# Altium project Edge_Card_Ucc28951.PrjPcb (part 3 of 3)

## Sheet Ucc_28951_Breakout.SchDoc
size C
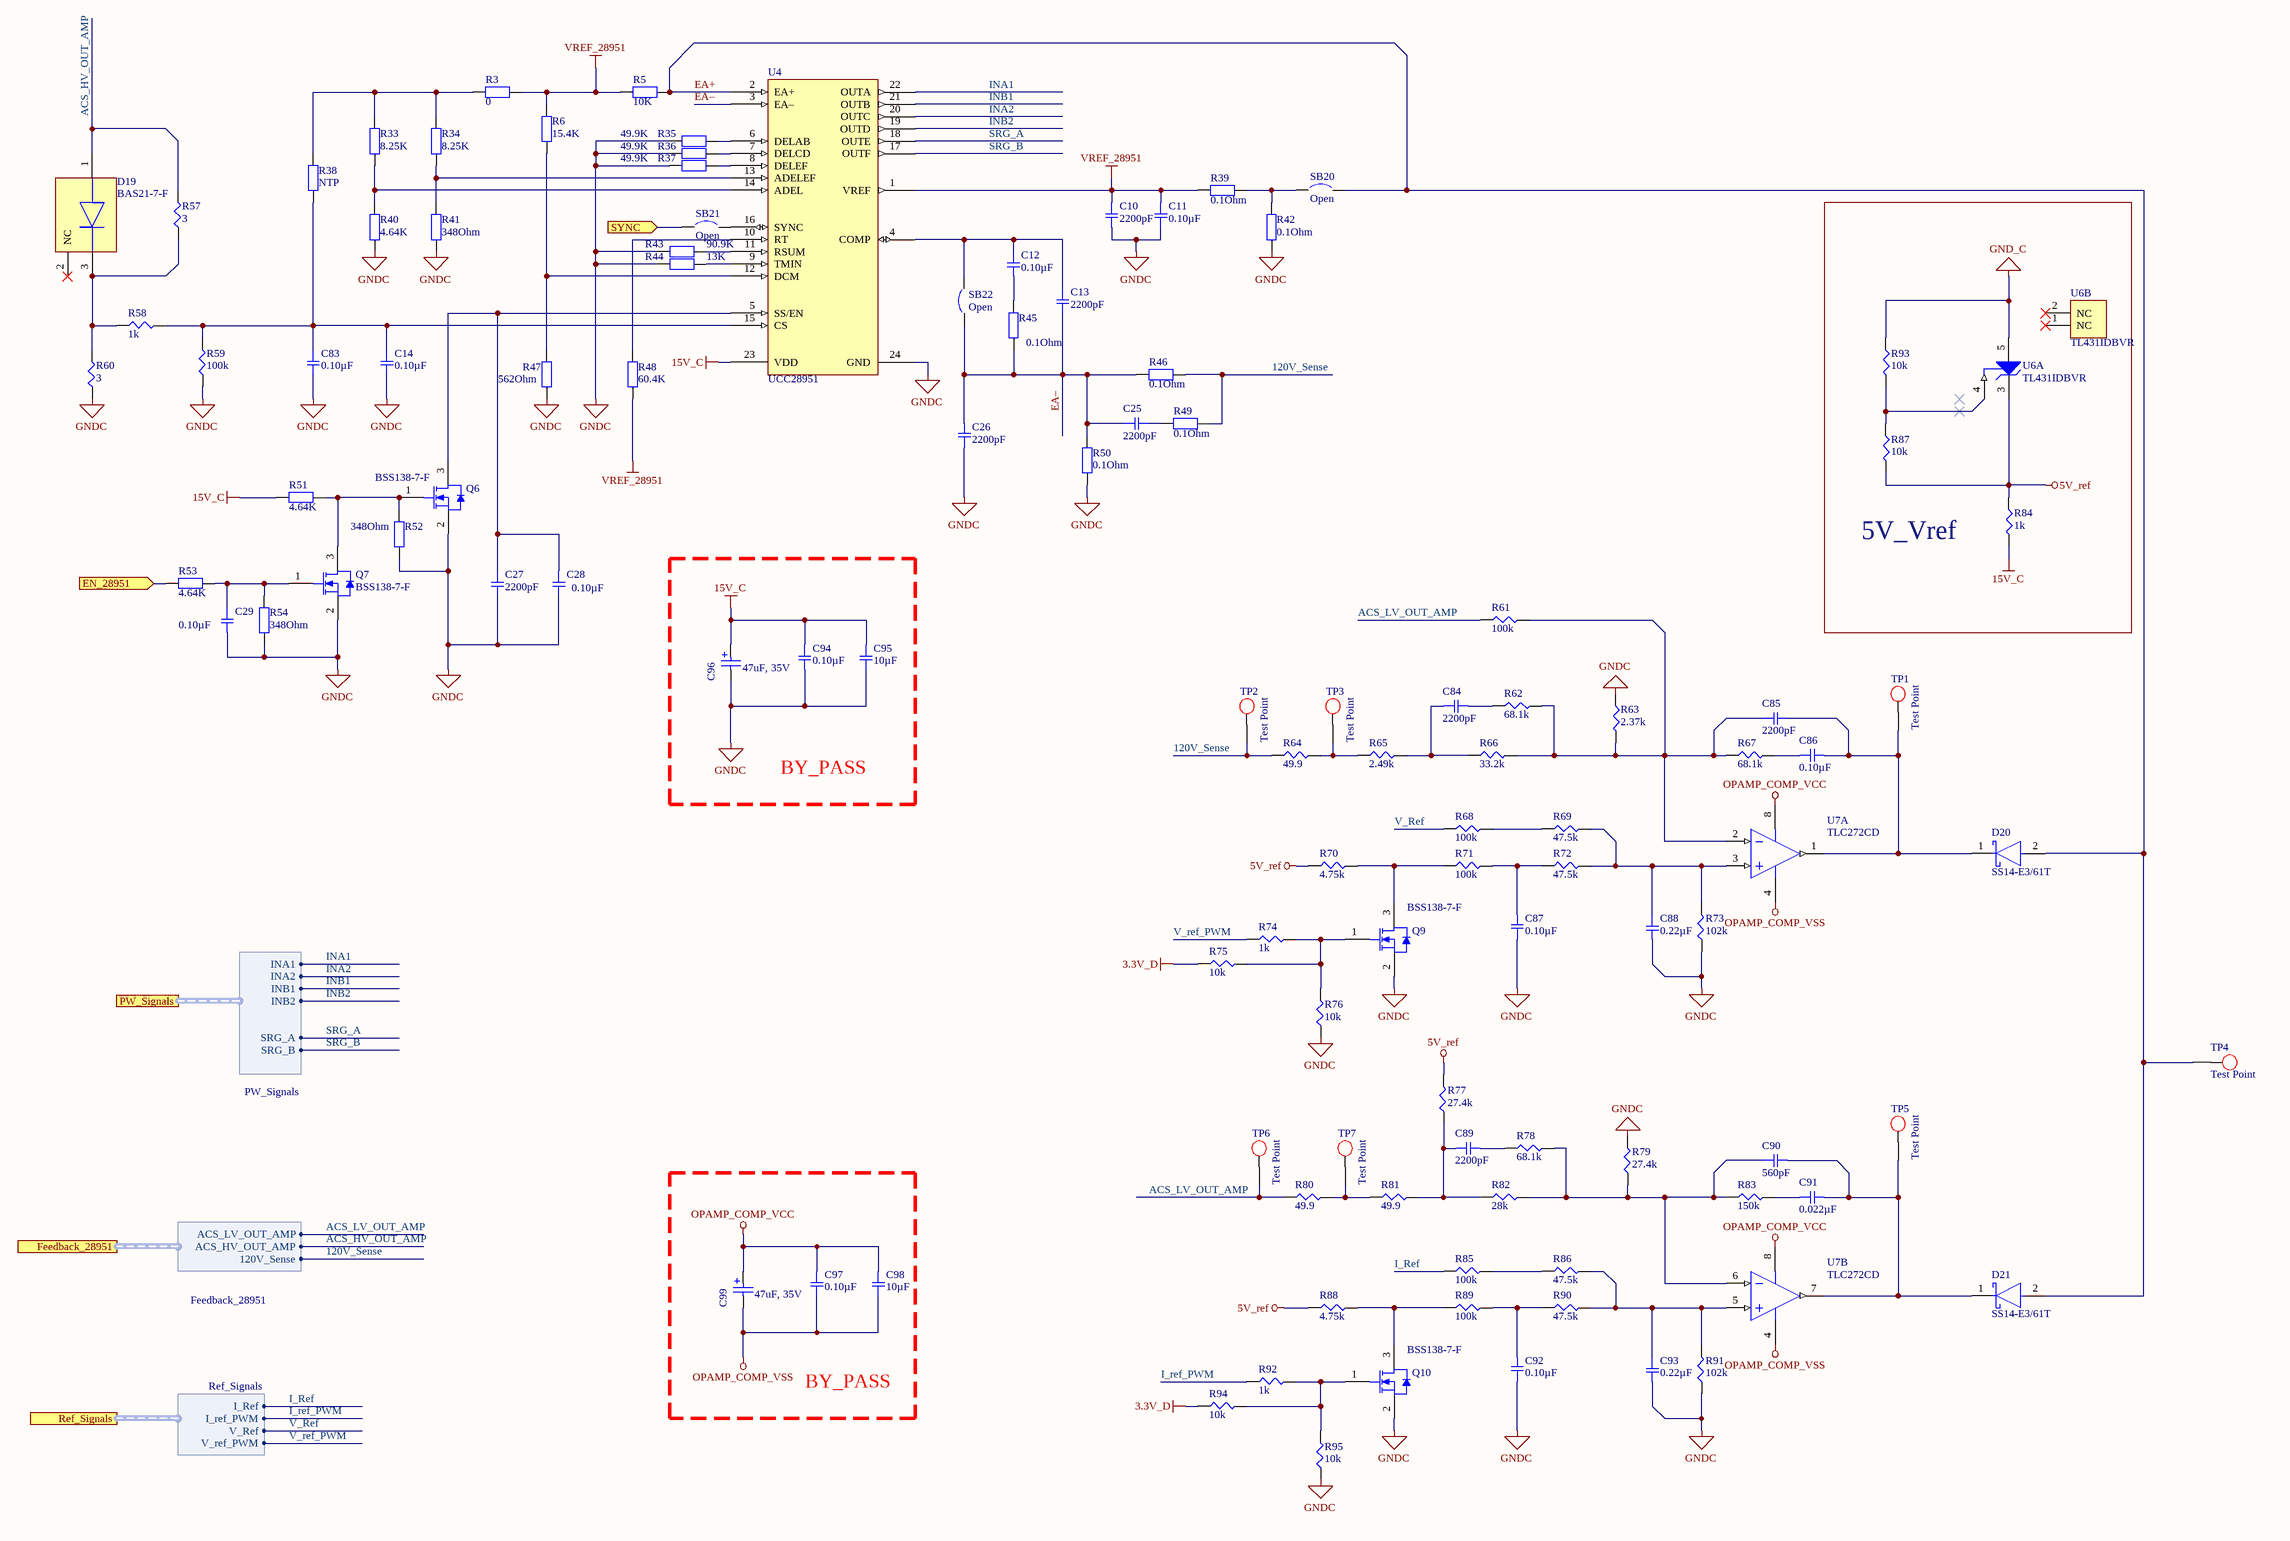
[diagram p11: Ucc_28951_Breakout.SchDoc]

### Parts
C10  2200pF  [SMD-0805C]
C11  0.10µF  [SMD-0805C]
C12  0.10µF  [SMD-0805C]
C13  2200pF  [SMD-0805C]
C14  0.10µF  [SMD-0805C]
C25  2200pF  [SMD-0805C]
C26  2200pF  [SMD-0805C]
C27  2200pF  [SMD-0805C]
C28  0.10µF  [SMD-0805C]
C29  0.10µF  [SMD-0805C]
C83  0.10µF  [SMD-0805C]
C84  2200pF  [SMD-0603C]
C85  2200pF  [SMD-0603C]
C86  0.10µF  [SMD-0603C]
C87  0.10µF  [SMD-0603C]
C88  0.22µF  [SMD-0603C]
C89  2200pF  [SMD-0603C]
C90  560pF  [SMD-0603C]
C91  0.022µF  [SMD-0603C]
C92  0.10µF  [SMD-0603C]
C93  0.22µF  [SMD-0603C]
C94  0.10µF  [SMD-0805C]
C95  10µF  [SMD-0805C]
C96  47uF, 35V  [WCAP-ASLU_8x6.5]
C97  0.10µF  [SMD-0805C]
C98  10µF  [SMD-0805C]
C99  47uF, 35V  [WCAP-ASLU_8x6.5]
D19  BAS21-7-F  [FP-SOT23-MFG]
D20  SS14-E3/61T  [FP-95400-MFG]
D21  SS14-E3/61T  [FP-95400-MFG]
Q6  BSS138-7-F  [DIOD-SOT23-3_V]
Q7  BSS138-7-F  [DIOD-SOT23-3_V]
Q9  BSS138-7-F  [DIOD-SOT23-3_V]
Q10  BSS138-7-F  [DIOD-SOT23-3_V]
R3  0  [WRIS-KSKE_0603_H=0.45mm]
R5  10K  [WRIS-KSKE_0603_H=0.45mm]
R6  15.4K  [WRIS-KSKE_0603_H=0.45mm]
R33  8.25K  [WRIS-KSKE_0603_H=0.45mm]
R34  8.25K  [WRIS-KSKE_0603_H=0.45mm]
R35  49.9K  [WRIS-KSKE_0603_H=0.45mm]
R36  49.9K  [WRIS-KSKE_0603_H=0.45mm]
R37  49.9K  [WRIS-KSKE_0603_H=0.45mm]
R38  NTP  [WRIS-KSKE_0603_H=0.45mm]
R39  0.1Ohm  [WRIS-KSKE_0603_H=0.45mm]
R40  4.64K  [WRIS-KSKE_0603_H=0.45mm]
R41  348Ohm  [WRIS-KSKE_0603_H=0.45mm]
R42  0.1Ohm  [WRIS-KSKE_0603_H=0.45mm]
R43  90.9K  [WRIS-KSKE_0603_H=0.45mm]
R44  13K  [WRIS-KSKE_0603_H=0.45mm]
R45  0.1Ohm  [WRIS-KSKE_0603_H=0.45mm]
R46  0.1Ohm  [WRIS-KSKE_0603_H=0.45mm]
R47  562Ohm  [WRIS-KSKE_0603_H=0.45mm]
R48  60.4K  [WRIS-KSKE_0603_H=0.45mm]
R49  0.1Ohm  [WRIS-KSKE_0603_H=0.45mm]
R50  0.1Ohm  [WRIS-KSKE_0603_H=0.45mm]
R51  4.64K  [WRIS-KSKE_0603_H=0.45mm]
R52  348Ohm  [WRIS-KSKE_0603_H=0.45mm]
R53  4.64K  [WRIS-KSKE_0603_H=0.45mm]
R54  348Ohm  [WRIS-KSKE_0603_H=0.45mm]
R57  3  [SMD-0603-RES]
R58  1k  [SMD-0603-RES]
R59  100k  [SMD-0603-RES]
R60  3  [SMD-0603-RES]
R61  100k  [SMD-0603-RES]
R62  68.1k  [SMD-0603-RES]
R63  2.37k  [SMD-0603-RES]
R64  49.9  [SMD-0603-RES]
R65  2.49k  [SMD-0603-RES]
R66  33.2k  [SMD-0603-RES]
R67  68.1k  [SMD-0603-RES]
R68  100k  [SMD-0603-RES]
R69  47.5k  [SMD-0603-RES]
R70  4.75k  [SMD-0603-RES]
R71  100k  [SMD-0603-RES]
R72  47.5k  [SMD-0603-RES]
R73  102k  [SMD-0603-RES]
R74  1k  [SMD-0603-RES]
R75  10k  [SMD-0603-RES]
R76  10k  [SMD-0603-RES]
R77  27.4k  [SMD-0603-RES]
R78  68.1k  [SMD-0603-RES]
R79  27.4k  [SMD-0603-RES]
R80  49.9  [SMD-0603-RES]
R81  49.9  [SMD-0603-RES]
R82  28k  [SMD-0603-RES]
R83  150k  [SMD-0603-RES]
R84  1k  [SMD-0603-RES]
R85  100k  [SMD-0603-RES]
R86  47.5k  [SMD-0603-RES]
R87  10k  [SMD-0603-RES]
R88  4.75k  [SMD-0603-RES]
R89  100k  [SMD-0603-RES]
R90  47.5k  [SMD-0603-RES]
R91  102k  [SMD-0603-RES]
R92  1k  [SMD-0603-RES]
R93  10k  [SMD-0603-RES]
R94  10k  [SMD-0603-RES]
R95  10k  [SMD-0603-RES]
SB20  Open  [SB_0603]  (no BOM)
SB21  Open  [SB_0603]  (no BOM)
SB22  Open  [SB_0603]  (no BOM)
TP1  Test Point  [Test_point_THT]  (no BOM)
TP2  Test Point  [Test_point_THT]  (no BOM)
TP3  Test Point  [Test_point_THT]  (no BOM)
TP4  Test Point  [Test_point_THT]  (no BOM)
TP5  Test Point  [Test_point_THT]  (no BOM)
TP6  Test Point  [Test_point_THT]  (no BOM)
TP7  Test Point  [Test_point_THT]  (no BOM)
U4  UCC28951  [TSOP65P640X120_HS-25N]
U6  TL431IDBVR  [DBV0005A_M]  (parts A,B of 2)
U7  TLC272CD  [D0008A_N]  (parts A,B of 2)

### Blocks framed on the sheet
5V_Vref: R84 R87 R93 U6
BY_PASS: C94-C96
BY_PASS: C97-C99

### Ports
EN_28951 (in), Feedback_28951 (harness Feedback_28951), PW_Signals (harness PW_Signals), Ref_Signals (harness Ref_Signals), SYNC (in)

### Harnesses
PW_Signals: INA1, INA2, INB1, INB2, SRG_A, SRG_B
Feedback_28951: 120V_Sense, ACS_HV_OUT_AMP, ACS_LV_OUT_AMP
Ref_Signals: I_Ref, I_ref_PWM, V_Ref, V_ref_PWM

### Nets
3.3V_D: R75.1 R94.1
5V_ref: R70.1 R77.2 R84.1 R87.2 R88.1 U6.3(CATHODE)
15V_C: C94.1 C95.1 C96.2(P) R51.1 R84.2 U4.23(VDD)
GND_C: R93.1 U6.5(ANODE)
GNDC: C10.2 C11.2 C14.2 C26.1 C27.2 C28.2 C29.2 C83.2 C87.1 C88.2 C92.1 C93.2 C94.2 C95.2 C96.1(N) Q6.2(S) Q7.2(S) Q9.2(S) Q10.2(S) R35.2 R36.2 R37.2 R40.2 R41.2 R42.2 R43.2 R44.2 R47.2 R50.2 R52.2 R54.2 R59.1 R60.1 R63.1 R73.1 R76.1 R79.2 R91.1 R95.1 U4.24(GND)
OPAMP_COMP_VCC: C97.1 C98.1 C99.2(P) U7.8(VDD)
OPAMP_COMP_VSS: C97.2 C98.2 C99.1(N) U7.4(GND)
VREF_28951: C10.1 C11.1 R3.1 R5.2 R6.1 R39.1 R48.2 U4.1(VREF)
120V_Sense: R46.1 R49.1 R64.1 TP2.1 ; port Feedback_28951.120V_Sense
ACS_HV_OUT_AMP: D19.1(A) R57.2 ; port Feedback_28951.ACS_HV_OUT_AMP
ACS_LV_OUT_AMP: R61.1 R80.1 TP6.1 ; port Feedback_28951.ACS_LV_OUT_AMP
EA+: D20.2(A) D21.2(A) R5.1 SB20.2 TP4.1 U4.2(EA+)
EA–: C13.2 C25.1 C26.2 R45.1 R46.2 R50.1 SB22.1 U4.3(EA–)
EN_28951: R53.1 ; port EN_28951
I_Ref: R85.1 ; port Ref_Signals.I_Ref
I_ref_PWM: R92.1 ; port Ref_Signals.I_ref_PWM
INA1: U4.22(OUTA) ; port PW_Signals.INA1
INA2: U4.20(OUTC) ; port PW_Signals.INA2
INB1: U4.21(OUTB) ; port PW_Signals.INB1
INB2: U4.19(OUTD) ; port PW_Signals.INB2
SRG_A: U4.18(OUTE) ; port PW_Signals.SRG_A
SRG_B: U4.17(OUTF) ; port PW_Signals.SRG_B
SYNC: SB21.1 ; port SYNC
V_Ref: R68.1 ; port Ref_Signals.V_Ref
V_ref_PWM: R74.1 ; port Ref_Signals.V_ref_PWM
NetC12_1: C12.1 C13.1 SB22.2 U4.4(COMP)
NetC12_2: C12.2 R45.2
NetC14_1: C14.1 C83.1 R38.2 R58.2 R59.2 U4.15(CS)
NetC25_2: C25.2 R49.2
NetC27_1: C27.1 C28.1 Q6.3(D) U4.5(SS/EN)
NetC29_1: C29.1 Q7.1(G) R53.2 R54.1
NetC84_1: C84.1 R65.2 R66.1
NetC84_2: C84.2 R62.1
NetC85_1: C85.1 R61.2 R62.2 R63.2 R66.2 R67.1 U7.2(IN1-)
NetC85_2: C85.2 C86.2 D20.1(C) TP1.1 U7.1(OUT1)
NetC86_1: C86.1 R67.2
NetC87_2: C87.2 R71.2 R72.1
NetC88_1: C88.1 R69.2 R72.2 R73.2 U7.3(IN1+)
NetC89_1: C89.1 R77.1 R81.2 R82.1
NetC89_2: C89.2 R78.1
NetC90_1: C90.1 R78.2 R79.1 R82.2 R83.1 U7.6(IN2-)
NetC90_2: C90.2 C91.2 D21.1(C) TP5.1 U7.7(OUT2)
NetC91_1: C91.1 R83.2
NetC92_2: C92.2 R89.2 R90.1
NetC93_1: C93.1 R86.2 R90.2 R91.2 U7.5(IN2+)
NetD19_3: D19.3(C) R57.1 R58.1 R60.2
NetQ6_1: Q6.1(G) Q7.3(D) R51.2 R52.1
NetQ9_1: Q9.1(G) R74.2 R75.2 R76.2
NetQ9_3: Q9.3(D) R70.2 R71.1
NetQ10_1: Q10.1(G) R92.2 R94.2 R95.2
NetQ10_3: Q10.3(D) R88.2 R89.1
NetR3_2: R3.2 R33.1 R34.1 R38.1
NetR6_2: R6.2 R47.1 U4.12(DCM)
NetR33_2: R33.2 R40.1 U4.14(ADEL)
NetR34_2: R34.2 R41.1 U4.13(ADELEF)
NetR35_1: R35.1 U4.6(DELAB)
NetR36_1: R36.1 U4.7(DELCD)
NetR37_1: R37.1 U4.8(DELEF)
NetR39_2: R39.2 R42.1 SB20.1
NetR43_1: R43.1 U4.11(RSUM)
NetR44_1: R44.1 U4.9(TMIN)
NetR48_1: R48.1 U4.10(RT)
NetR64_2: R64.2 R65.1 TP3.1
NetR68_2: R68.2 R69.1
NetR80_2: R80.2 R81.1 TP7.1
NetR85_2: R85.2 R86.1
NetR87_1: R87.1 R93.2 U6.4(REF)
NetSB21_2: SB21.2 U4.16(SYNC)

Not connected (* = marked no-connect by the designer): D19 2(NC)*; U6 1(NC)* 2(NC)*

### Library data of the parts
C10 C13 C25-C27 = GCM216R72A222KA37D: CAP CER 2200PF 100V X7R 0805; Manufacturer: Murata Electronics North America; Factory Stock: 0; Unit Price (USD): 0.19; Minimum Quantity: 1; Tolerance: ±10%; Datasheets: http://www.murata.com/~/media/webrenewal/support/library/catalog/products/capacitor/mlcc/c03e.ashx; Image: //media.digikey.com/Renders/Murata%20Renders/0805%28GxM6%29.jpg; Digi-Key Part Number: 490-6061-1-ND; Part Number: GCM216R72A222KA37D; Quantity Available: 13779; @ qty: 0; Packaging: Cut Tape (CT); Series: GCM; Part Status: Active; Value: 2200pF; Voltage: 100V; Temperature Coefficient: X7R; Operating Temperature: -55°C ~ 125°C; Features: -; Ratings: AEC-Q200; Applications: Automotive; Mounting Type: Surface Mount, MLCC; Package / Case: 0805 (2012 Metric); Size / Dimension: 0.079" L x 0.049" W (2.00mm x 1.25mm); Height - Seated (Max): -; Thickness (Max): 0.028" (0.70mm); Lead Spacing: -; Lead Style: -
C11 C12 C14 C28 C29 C83 = GCD21BR71H104KA01L: CAP CER 0.1UF 50V X7R 0805; Manufacturer: Murata Electronics North America; Factory Stock: 0; Unit Price (USD): 0.24; Minimum Quantity: 1; Tolerance: ±10%; Datasheets: http://www.murata.com/~/media/webrenewal/support/library/catalog/products/capacitor/mlcc/c03e.ashx; Image: //media.digikey.com/Renders/Murata%20Renders/0805%28GxM6%29.jpg; Digi-Key Part Number: 490-11955-1-ND; Part Number: GCD21BR71H104KA01L; Quantity Available: 157; @ qty: 0; Packaging: Cut Tape (CT); Series: GCD; Part Status: Active; Value: 0.10µF; Voltage: 50V; Temperature Coefficient: X7R; Operating Temperature: -55°C ~ 125°C; Features: -; Ratings: AEC-Q200; Applications: Automotive; Mounting Type: Surface Mount, MLCC; Package / Case: 0805 (2012 Metric); Size / Dimension: 0.079" L x 0.049" W (2.00mm x 1.25mm); Height - Seated (Max): -; Thickness (Max): 0.049" (1.25mm); Lead Spacing: -; Lead Style: -
C84 C85 C89 = GCJ188R71H222KA01D: CAP CER 2200PF 50V X7R 0603; Manufacturer: Murata Electronics North America; Factory Stock: 0; Unit Price (USD): 0.16; Minimum Quantity: 1; Tolerance: ±10%; Datasheets: http://www.murata.com/~/media/webrenewal/support/library/catalog/products/capacitor/mlcc/c03e.ashx; Image: //media.digikey.com/Renders/Murata%20Renders/0603%28LQG18%29.jpg; Digi-Key Part Number: 490-5766-1-ND; Part Number: GCJ188R71H222KA01D; Quantity Available: 34786; @ qty: 0; Packaging: Cut Tape (CT); Series: GCJ; Part Status: Active; Value: 2200pF; Voltage: 50V; Temperature Coefficient: X7R; Operating Temperature: -55°C ~ 125°C; Features: Soft Termination; Ratings: AEC-Q200; Applications: Automotive, Boardflex Sensitive; Mounting Type: Surface Mount, MLCC; Package / Case: 0603 (1608 Metric); Size / Dimension: 0.063" L x 0.031" W (1.60mm x 0.80mm); Height - Seated (Max): -; Thickness (Max): 0.031" (0.80mm); Lead Spacing: -; Lead Style: -
C86 C87 C92 = GCJ188R71C104KA01D: CAP CER 0.1UF 16V X7R 0603; Manufacturer: Murata Electronics North America; Factory Stock: 0; Unit Price (USD): 0.21; Minimum Quantity: 1; Tolerance: ±10%; Datasheets: http://www.murata.com/~/media/webrenewal/support/library/catalog/products/capacitor/mlcc/c03e.ashx; Image: //media.digikey.com/Renders/Murata%20Renders/0603%28LQG18%29.jpg; Digi-Key Part Number: 490-5796-1-ND; Part Number: GCJ188R71C104KA01D; Quantity Available: 22473; @ qty: 0; Packaging: Cut Tape (CT); Series: GCJ; Part Status: Active; Value: 0.10µF; Voltage: 16V; Temperature Coefficient: X7R; Operating Temperature: -55°C ~ 125°C; Features: Soft Termination; Ratings: AEC-Q200; Applications: Automotive, Boardflex Sensitive; Mounting Type: Surface Mount, MLCC; Package / Case: 0603 (1608 Metric); Size / Dimension: 0.063" L x 0.031" W (1.60mm x 0.80mm); Height - Seated (Max): -; Thickness (Max): 0.035" (0.90mm); Lead Spacing: -; Lead Style: -
C88 C93 = GCJ188R71E224KA12D: CAP CER 0.22UF 25V X7R 0603; Manufacturer: Murata Electronics North America; Factory Stock: 0; Unit Price (USD): 0.24; Minimum Quantity: 1; Tolerance: ±10%; Datasheets: http://www.murata.com/~/media/webrenewal/support/library/catalog/products/capacitor/mlcc/c03e.ashx; Image: //media.digikey.com/Renders/Murata%20Renders/0603%28LQG18%29.jpg; Digi-Key Part Number: 490-5797-1-ND; Part Number: GCJ188R71E224KA12D; Quantity Available: 23903; @ qty: 0; Packaging: Cut Tape (CT); Series: GCJ; Part Status: Active; Value: 0.22µF; Voltage: 25V; Temperature Coefficient: X7R; Operating Temperature: -55°C ~ 125°C; Features: Soft Termination; Ratings: AEC-Q200; Applications: Automotive, Boardflex Sensitive; Mounting Type: Surface Mount, MLCC; Package / Case: 0603 (1608 Metric); Size / Dimension: 0.063" L x 0.031" W (1.60mm x 0.80mm); Height - Seated (Max): -; Thickness (Max): 0.035" (0.90mm); Lead Spacing: -; Lead Style: -
C90 = GRM1885C1E561JA01D: CAP CER 560PF 25V NP0 0603; Manufacturer: Murata Electronics North America; Factory Stock: 0; Unit Price (USD): 0.12; Minimum Quantity: 1; Tolerance: ±5%; Temperature Coefficient: C0G, NP0; Datasheets: http://www.murata.com/~/media/webrenewal/support/library/catalog/products/capacitor/mlcc/c02e.pdf; Image: //media.digikey.com/Renders/Murata%20Renders/ZRB-SERIES-0402.jpg; Digi-Key Part Number: 490-12711-1-ND; Part Number: GRM1885C1E561JA01D; Quantity Available: 11490; @ qty: 0; Packaging: Cut Tape (CT); Series: GRM; Part Status: Active; Value: 560pF; Voltage: 25V; Operating Temperature: -55°C ~ 125°C; Features: -; Ratings: -; Applications: General Purpose; Mounting Type: Surface Mount, MLCC; Package / Case: 0603 (1608 Metric); Size / Dimension: 0.063" L x 0.031" W (1.60mm x 0.80mm); Height - Seated (Max): -; Thickness (Max): 0.035" (0.90mm); Lead Spacing: -; Lead Style: -
C91 = GCJ188R71H223KA01D: CAP CER 0.022UF 50V X7R 0603; Manufacturer: Murata Electronics North America; Factory Stock: 0; Unit Price (USD): 0.22; Minimum Quantity: 1; Tolerance: ±10%; Datasheets: http://www.murata.com/~/media/webrenewal/support/library/catalog/products/capacitor/mlcc/c03e.ashx; Image: //media.digikey.com/Renders/Murata%20Renders/0603%28LQG18%29.jpg; Digi-Key Part Number: 490-5851-1-ND; Part Number: GCJ188R71H223KA01D; Quantity Available: 7651; @ qty: 0; Packaging: Cut Tape (CT); Series: GCJ; Part Status: Active; Value: 0.022µF; Voltage: 50V; Temperature Coefficient: X7R; Operating Temperature: -55°C ~ 125°C; Features: Soft Termination; Ratings: AEC-Q200; Applications: Automotive, Boardflex Sensitive; Mounting Type: Surface Mount, MLCC; Package / Case: 0603 (1608 Metric); Size / Dimension: 0.063" L x 0.031" W (1.60mm x 0.80mm); Height - Seated (Max): -; Thickness (Max): 0.031" (0.80mm); Lead Spacing: -; Lead Style: -
C94 C97 = GCJ21BR72A104KA01L: CAP CER 0.1UF 100V X7R 0805; Manufacturer: Murata Electronics North America; Factory Stock: 0; Unit Price (USD): 0.32; Minimum Quantity: 1; Tolerance: ±10%; Datasheets: http://www.murata.com/~/media/webrenewal/support/library/catalog/products/capacitor/mlcc/c03e.ashx; Image: //media.digikey.com/Renders/Murata%20Renders/0805%20(2012%20Metric)%20.85mm.jpg; Digi-Key Part Number: 490-5825-1-ND; Part Number: GCJ21BR72A104KA01L; Quantity Available: 1873; @ qty: 0; Packaging: Cut Tape (CT); Series: GCJ; Part Status: Active; Value: 0.10µF; Voltage: 100V; Temperature Coefficient: X7R; Operating Temperature: -55°C ~ 125°C; Features: Soft Termination; Ratings: AEC-Q200; Applications: Automotive, Boardflex Sensitive; Mounting Type: Surface Mount, MLCC; Package / Case: 0805 (2012 Metric); Size / Dimension: 0.079" L x 0.049" W (2.00mm x 1.25mm); Height - Seated (Max): -; Thickness (Max): 0.049" (1.25mm); Lead Spacing: -; Lead Style: -
C95 C98 = GCM21BR71A106KE22L: CAP CER 10UF 10V X7R 0805; Manufacturer: Murata Electronics North America; Factory Stock: 0; Unit Price (USD): 0.49; Minimum Quantity: 1; Tolerance: ±10%; Datasheets: http://www.murata.com/~/media/webrenewal/support/library/catalog/products/capacitor/mlcc/c03e.ashx; Image: //media.digikey.com/photos/Murata%20Photos/NCP,GCM%20SERIES%200805.jpg; Digi-Key Part Number: 490-10674-1-ND; Part Number: GCM21BR71A106KE22L; Quantity Available: 125344; @ qty: 0; Packaging: Cut Tape (CT); Series: GCM; Part Status: Active; Value: 10µF; Voltage: 10V; Temperature Coefficient: X7R; Operating Temperature: -55°C ~ 125°C; Features: -; Ratings: AEC-Q200; Applications: Automotive; Mounting Type: Surface Mount, MLCC; Package / Case: 0805 (2012 Metric); Size / Dimension: 0.079" L x 0.049" W (2.00mm x 1.25mm); Height - Seated (Max): -; Thickness (Max): 0.055" (1.40mm); Lead Spacing: -; Lead Style: -
C96 C99 = 865090549009: WCAP-ASLU Aluminium Electrolytic Capacitors, D8mm x L6.5mm, 47uF, +/-20%, 35VDC; Dissipation Factor: 14%; Leakage Current: 3.29uA; Endurance: 1000h; Technical Reference: ASBE065470M035DVCTBA000; Ripple Current max.: 80mA; ComponentLink1Description: Manufacturer; ComponentLink1URL: http://www.we-online.de; ComponentLink2Description: Datasheet; ComponentLink2URL: https://katalog.we-online.com/pbs/datasheet/865090549009.pdf; Mounting Technology: SMD; Operating Temperature: -40 to +85degC; Packaging: Tape and Reel; Part Number: 865090549009; Publisher: Wurth Elektronik; Capacitance: 47uF; Diameter: 8mm; Length: 6.5mm; Published Date: August 2019; Rated Voltage: 35VDC; Capacitance Tolerance: +/-20%
D19 = CMP-12791-000036-1: DIODE GEN PURP 200V 200MA SOT23; Manufacturer: Diodes Inc.; Max Repetitive Reverse Voltage: 250V; Forward Current: 400mA; Max Surge Forward Current: 0.5A; Standoff Height: 0.013mm; Capacitance: 5pF; Max Junction Temp: +150°C; Peak Reverse Current: 0.1uA; Value: 5pF; Device Class L1: Discrete Semiconductors; Category: Diode; Mouser Description: Diodes - General Purpose, Power, Switching 200V 350mW; Digikey Description: DIODE GEN PURP 200V 200MA SOT23; Manufacturer Part Number: BAS21-7-F; Device Class L2: Diodes; RoHS: TRUE; Device Class L3: Rectifier Diodes; Lead Free: Yes; Temperature Range High: +150°C; Ipc Land Pattern Name: SOT92P240X102-3; ComponentLink2Description: Datasheet; Octopart: https://octopart.com/bas21-7-f-diodes+inc.-325943; Reverse Voltage: 200V; Height: 1.1mm; Automotive: No; ComponentLink2URL: https://www.diodes.com/assets/Datasheets/Ds12004.pdf; Temperature: -65°C to +150°C; Temperature Range Low: -65°C; Footprint Url: https://www.diodes.com/assets/Package-Files/SOT23.pdf; Package: SOT23
D20 D21 = CMP-02539-000035-1: DIODE SCHOTTKY 40V 1A DO214AC; Manufacturer: Vishay; Peak Reverse Current: 0.2mA; Standoff Height: 0mm; Max Junction Temp: +150°C; Max Surge Forward Current: 40A; RoHS: TRUE; Digikey Description: DIODE SCHOTTKY 40V 1A DO214AC; Category: Diode; Device Class L3: Schottky Diodes; Temperature Range High: +150°C; Automotive: No; Temperature: -65°C to +150°C; Device Class L2: Diodes; Forward Current: 1A; Temperature Range Low: -65°C; Footprint Url: http://www.vishay.com/docs/95400/sma.pdf; Octopart: https://octopart.com/ss14-e3%2F61t-vishay-39552847; Package: 95400; Max Repetitive Reverse Voltage: 40V; ComponentLink2Description: Datasheet; ComponentLink2URL: http://www.vishay.com/docs/88746/ss12.pdf; Lead Free: Yes; Height: 2.29mm; Mouser Description: SS14 Series 40 V 1 A Surface Mount Schottky Barrier Rectifier - DO-214AC (SMA); Manufacturer Part Number: SS14-E3/61T; Device Class L1: Discrete Semiconductors
Q6 Q7 Q9 Q10 = CMP-2000-04930-1: N-Channel Enhancement Mode Mosfet, 50 V, 0.2 A, -55 to 150 degC, 3-Pin SOT23, RoHS, Tape and Reel; Manufacturer: Diodes Inc; Brand: DiodesIncorporated; Unit Weight: 0.000282oz; Pd - Power Dissipation: 300mW; Id - Continuous Drain Current: 200mA; Rds On - Drain-Source Resistance: 3.5Ohms; Vgs - Gate-Source Voltage: 20V; Number of Channels: 1Channel; Vds - Drain-Source Breakdown Voltage: 50V; Transistor Type: 1N-Channel; Typical Turn-Off Delay Time: 20ns; Configuration: Single; Mounting Style: SMD/SMT; Height: 1mm; Package Description: 3-Pin Small Outline Transistor, Body 2.9 x 1.3 mm, Pitch 0.96 mm; Datasheet Version: Rev. 20-2, 11/2013; Minimum Operating Temperature: -55C; Package / Case: SOT-23-3; Channel Mode: Enhancement; Product: MOSFETSmallSignal; Packaging: Reel; Maximum Operating Temperature: +150C; Datasheet URL: https://datasheet.ciiva.com/8115/ds30144-8115344.pdf; Product Category: MOSFET; Width: 1.3mm; Technology: Si; Package Reference: SOT23-3; Manufacturer URL: http://www.diodes.com/; Transistor Polarity: N-Channel; Length: 2.9mm; Factory Pack Quantity: 3000; Series: BSS138; RoHS: True; Typical Turn-On Delay Time: 20ns
R3 R5 R6 R33-R54 = 560050316001: WRIS-KSKE Thick Film Resistors, size 0603, 0.1Ohm, +/-1%, 0.25W; Rated Current: 1.58A; Temperature Coefficient of Resistance: 250ppm/degC; Technical Reference: KE0603R100F104LAATP0000; ComponentLink1Description: Manufacturer; ComponentLink1URL: http://www.we-online.de; ComponentLink2Description: Datasheet; ComponentLink2URL: https://katalog.we-online.com/pbs/datasheet/560050316001.pdf; Publisher: Wurth Elektronik; Rated Power: 0.25W; Resistance: 0.1Ohm; Mounting Technology: SMT; Height: 0.45mm; Part Number: 560050316001; Packaging: Tape and Reel; Published Date: September 2019; Size: 0603; Length: 1.6mm; Operating Temperature: -55 to +155degC; Resistance Tolerance: +/-1%; Width: 0.8mm
R57 R60 = ERJ-3BQF3R0V: RES SMD 3 OHM 1% 1/4W 0603; Manufacturer: Panasonic Electronic Components; Factory Stock: 0; Unit Price (USD): 0.05386; @ qty: 1500; Minimum Quantity: 1; Power (Watts): 0.25W, 1/4W; Temperature Coefficient: ±200ppm/°C; Part Number: ERJ-3BQF3R0V; Datasheets: https://industrial.panasonic.com/cdbs/www-data/pdf/RDA0000/AOA0000C239.pdf; Image: //media.digikey.com/Photos/Panasonic%20Photos/MFG_ERJ-P6W%20Series.jpg; Digi-Key Part Number: P17381CT-ND; Quantity Available: 984; Packaging: Cut Tape (CT); Series: ERJ; Part Status: Active; Value: 3; Tolerance: ±1%; Composition: Thick Film; Features: Automotive AEC-Q200, Current Sense; Operating Temperature: -55°C ~ 125°C; Package / Case: 0603 (1608 Metric); Supplier Device Package: 0603; Size / Dimension: 0.063" L x 0.031" W (1.60mm x 0.80mm); Height - Seated (Max): 0.022" (0.55mm); Number of Terminations: 2; Failure Rate: -
R58 R74 R84 R92 = ERJ-3EKF1001V: RES SMD 1K OHM 1% 1/10W 0603; Manufacturer: Panasonic Electronic Components; Factory Stock: 0; Unit Price (USD): 0.00379; @ qty: 1500; Minimum Quantity: 1; Power (Watts): 0.1W, 1/10W; Temperature Coefficient: ±100ppm/°C; Part Number: ERJ-3EKF1001V; Datasheets: http://industrial.panasonic.com/www-cgi/jvcr13pz.cgi?E+PZ+3+AOA0002+ERJ3EKF1001V+7+WW; Image: //media.digikey.com/Photos/Panasonic%20Photos/MFG_ERJ-P6W%20Series.jpg; Digi-Key Part Number: P1.00KHCT-ND; Quantity Available: 5218845; Packaging: Cut Tape (CT); Series: ERJ; Part Status: Active; Value: 1k; Tolerance: ±1%; Composition: Thick Film; Features: Automotive AEC-Q200; Operating Temperature: -55°C ~ 155°C; Package / Case: 0603 (1608 Metric); Supplier Device Package: 0603; Size / Dimension: 0.063" L x 0.031" W (1.60mm x 0.80mm); Height - Seated (Max): 0.022" (0.55mm); Number of Terminations: 2; Failure Rate: -
R59 R61 R68 R71 R85 R89 = ERJ-3EKF1003V: RES SMD 100K OHM 1% 1/10W 0603; Manufacturer: Panasonic Electronic Components; Factory Stock: 0; Unit Price (USD): 0.00379; @ qty: 1500; Minimum Quantity: 1; Power (Watts): 0.1W, 1/10W; Temperature Coefficient: ±100ppm/°C; Part Number: ERJ-3EKF1003V; Datasheets: http://industrial.panasonic.com/www-cgi/jvcr13pz.cgi?E+PZ+3+AOA0002+ERJ3EKF1003V+7+WW; Image: //media.digikey.com/Photos/Panasonic%20Photos/MFG_ERJ-P6W%20Series.jpg; Digi-Key Part Number: P100KHCT-ND; Quantity Available: 2179804; Packaging: Cut Tape (CT); Series: ERJ; Part Status: Active; Value: 100k; Tolerance: ±1%; Composition: Thick Film; Features: Automotive AEC-Q200; Operating Temperature: -55°C ~ 155°C; Package / Case: 0603 (1608 Metric); Supplier Device Package: 0603; Size / Dimension: 0.063" L x 0.031" W (1.60mm x 0.80mm); Height - Seated (Max): 0.022" (0.55mm); Number of Terminations: 2; Failure Rate: -
R62 R67 R78 = ERJ-3EKF6812V: RES SMD 68.1K OHM 1% 1/10W 0603; Manufacturer: Panasonic Electronic Components; Factory Stock: 0; Unit Price (USD): 0.00379; @ qty: 1500; Minimum Quantity: 1; Power (Watts): 0.1W, 1/10W; Temperature Coefficient: ±100ppm/°C; Part Number: ERJ-3EKF6812V; Datasheets: http://industrial.panasonic.com/www-cgi/jvcr13pz.cgi?E+PZ+3+AOA0002+ERJ3EKF6812V+7+WW; Image: //media.digikey.com/Photos/Panasonic%20Photos/MFG_ERJ-P6W%20Series.jpg; Digi-Key Part Number: P68.1KHCT-ND; Quantity Available: 142245; Packaging: Cut Tape (CT); Series: ERJ; Part Status: Active; Value: 68.1k; Tolerance: ±1%; Composition: Thick Film; Features: Automotive AEC-Q200; Operating Temperature: -55°C ~ 155°C; Package / Case: 0603 (1608 Metric); Supplier Device Package: 0603; Size / Dimension: 0.063" L x 0.031" W (1.60mm x 0.80mm); Height - Seated (Max): 0.022" (0.55mm); Number of Terminations: 2; Failure Rate: -
R63 = ERJ-3EKF2371V: RES SMD 2.37K OHM 1% 1/10W 0603; Manufacturer: Panasonic Electronic Components; Factory Stock: 0; Unit Price (USD): 0.00379; @ qty: 1500; Minimum Quantity: 1; Power (Watts): 0.1W, 1/10W; Temperature Coefficient: ±100ppm/°C; Part Number: ERJ-3EKF2371V; Datasheets: http://industrial.panasonic.com/www-cgi/jvcr13pz.cgi?E+PZ+3+AOA0002+ERJ3EKF2371V+7+WW; Image: //media.digikey.com/Photos/Panasonic%20Photos/MFG_ERJ-P6W%20Series.jpg; Digi-Key Part Number: P2.37KHCT-ND; Quantity Available: 67994; Packaging: Cut Tape (CT); Series: ERJ; Part Status: Active; Value: 2.37k; Tolerance: ±1%; Composition: Thick Film; Features: Automotive AEC-Q200; Operating Temperature: -55°C ~ 155°C; Package / Case: 0603 (1608 Metric); Supplier Device Package: 0603; Size / Dimension: 0.063" L x 0.031" W (1.60mm x 0.80mm); Height - Seated (Max): 0.022" (0.55mm); Number of Terminations: 2; Failure Rate: -
R64 R80 R81 = ERJ-3EKF49R9V: RES SMD 49.9 OHM 1% 1/10W 0603; Manufacturer: Panasonic Electronic Components; Factory Stock: 0; Unit Price (USD): 0.00379; @ qty: 1500; Minimum Quantity: 1; Power (Watts): 0.1W, 1/10W; Temperature Coefficient: ±100ppm/°C; Part Number: ERJ-3EKF49R9V; Datasheets: http://industrial.panasonic.com/www-cgi/jvcr13pz.cgi?E+PZ+3+AOA0002+ERJ3EKF49R9V+7+WW; Image: //media.digikey.com/Photos/Panasonic%20Photos/MFG_ERJ-P6W%20Series.jpg; Digi-Key Part Number: P49.9HCT-ND; Quantity Available: 566023; Packaging: Cut Tape (CT); Series: ERJ; Part Status: Active; Value: 49.9; Tolerance: ±1%; Composition: Thick Film; Features: Automotive AEC-Q200; Operating Temperature: -55°C ~ 155°C; Package / Case: 0603 (1608 Metric); Supplier Device Package: 0603; Size / Dimension: 0.063" L x 0.031" W (1.60mm x 0.80mm); Height - Seated (Max): 0.022" (0.55mm); Number of Terminations: 2; Failure Rate: -
R65 = ERJ-3EKF2491V: RES SMD 2.49K OHM 1% 1/10W 0603; Manufacturer: Panasonic Electronic Components; Factory Stock: 0; Unit Price (USD): 0.00379; @ qty: 1500; Minimum Quantity: 1; Power (Watts): 0.1W, 1/10W; Temperature Coefficient: ±100ppm/°C; Part Number: ERJ-3EKF2491V; Datasheets: http://industrial.panasonic.com/www-cgi/jvcr13pz.cgi?E+PZ+3+AOA0002+ERJ3EKF2491V+7+WW; Image: //media.digikey.com/Photos/Panasonic%20Photos/MFG_ERJ-P6W%20Series.jpg; Digi-Key Part Number: P2.49KHCT-ND; Quantity Available: 210620; Packaging: Cut Tape (CT); Series: ERJ; Part Status: Active; Value: 2.49k; Tolerance: ±1%; Composition: Thick Film; Features: Automotive AEC-Q200; Operating Temperature: -55°C ~ 155°C; Package / Case: 0603 (1608 Metric); Supplier Device Package: 0603; Size / Dimension: 0.063" L x 0.031" W (1.60mm x 0.80mm); Height - Seated (Max): 0.022" (0.55mm); Number of Terminations: 2; Failure Rate: -
R66 = ERJ-3EKF3322V: RES SMD 33.2K OHM 1% 1/10W 0603; Manufacturer: Panasonic Electronic Components; Factory Stock: 0; Unit Price (USD): 0.00379; @ qty: 1500; Minimum Quantity: 1; Power (Watts): 0.1W, 1/10W; Temperature Coefficient: ±100ppm/°C; Part Number: ERJ-3EKF3322V; Datasheets: http://industrial.panasonic.com/www-cgi/jvcr13pz.cgi?E+PZ+3+AOA0002+ERJ3EKF3322V+7+WW; Image: //media.digikey.com/Photos/Panasonic%20Photos/MFG_ERJ-P6W%20Series.jpg; Digi-Key Part Number: P33.2KHCT-ND; Quantity Available: 337159; Packaging: Cut Tape (CT); Series: ERJ; Part Status: Active; Value: 33.2k; Tolerance: ±1%; Composition: Thick Film; Features: Automotive AEC-Q200; Operating Temperature: -55°C ~ 155°C; Package / Case: 0603 (1608 Metric); Supplier Device Package: 0603; Size / Dimension: 0.063" L x 0.031" W (1.60mm x 0.80mm); Height - Seated (Max): 0.022" (0.55mm); Number of Terminations: 2; Failure Rate: -
R69 R72 R86 R90 = ERJ-3EKF4752V: RES SMD 47.5K OHM 1% 1/10W 0603; Manufacturer: Panasonic Electronic Components; Factory Stock: 0; Unit Price (USD): 0.00379; @ qty: 1500; Minimum Quantity: 1; Power (Watts): 0.1W, 1/10W; Temperature Coefficient: ±100ppm/°C; Part Number: ERJ-3EKF4752V; Datasheets: http://industrial.panasonic.com/www-cgi/jvcr13pz.cgi?E+PZ+3+AOA0002+ERJ3EKF4752V+7+WW; Image: //media.digikey.com/Photos/Panasonic%20Photos/MFG_ERJ-P6W%20Series.jpg; Digi-Key Part Number: P47.5KHCT-ND; Quantity Available: 206719; Packaging: Cut Tape (CT); Series: ERJ; Part Status: Active; Value: 47.5k; Tolerance: ±1%; Composition: Thick Film; Features: Automotive AEC-Q200; Operating Temperature: -55°C ~ 155°C; Package / Case: 0603 (1608 Metric); Supplier Device Package: 0603; Size / Dimension: 0.063" L x 0.031" W (1.60mm x 0.80mm); Height - Seated (Max): 0.022" (0.55mm); Number of Terminations: 2; Failure Rate: -
R70 R88 = ERJ-3EKF4751V: RES SMD 4.75K OHM 1% 1/10W 0603; Manufacturer: Panasonic Electronic Components; Factory Stock: 0; Unit Price (USD): 0.00379; @ qty: 1500; Minimum Quantity: 1; Power (Watts): 0.1W, 1/10W; Temperature Coefficient: ±100ppm/°C; Part Number: ERJ-3EKF4751V; Datasheets: http://industrial.panasonic.com/www-cgi/jvcr13pz.cgi?E+PZ+3+AOA0002+ERJ3EKF4751V+7+WW; Image: //media.digikey.com/Photos/Panasonic%20Photos/MFG_ERJ-P6W%20Series.jpg; Digi-Key Part Number: P4.75KHCT-ND; Quantity Available: 358784; Packaging: Cut Tape (CT); Series: ERJ; Part Status: Active; Value: 4.75k; Tolerance: ±1%; Composition: Thick Film; Features: Automotive AEC-Q200; Operating Temperature: -55°C ~ 155°C; Package / Case: 0603 (1608 Metric); Supplier Device Package: 0603; Size / Dimension: 0.063" L x 0.031" W (1.60mm x 0.80mm); Height - Seated (Max): 0.022" (0.55mm); Number of Terminations: 2; Failure Rate: -
R73 R91 = ERJ-3EKF1023V: RES SMD 102K OHM 1% 1/10W 0603; Manufacturer: Panasonic Electronic Components; Factory Stock: 0; Unit Price (USD): 0.00379; @ qty: 1500; Minimum Quantity: 1; Power (Watts): 0.1W, 1/10W; Temperature Coefficient: ±100ppm/°C; Part Number: ERJ-3EKF1023V; Datasheets: http://industrial.panasonic.com/www-cgi/jvcr13pz.cgi?E+PZ+3+AOA0002+ERJ3EKF1023V+7+WW; Image: //media.digikey.com/Photos/Panasonic%20Photos/MFG_ERJ-P6W%20Series.jpg; Digi-Key Part Number: P102KHCT-ND; Quantity Available: 104216; Packaging: Cut Tape (CT); Series: ERJ; Part Status: Active; Value: 102k; Tolerance: ±1%; Composition: Thick Film; Features: Automotive AEC-Q200; Operating Temperature: -55°C ~ 155°C; Package / Case: 0603 (1608 Metric); Supplier Device Package: 0603; Size / Dimension: 0.063" L x 0.031" W (1.60mm x 0.80mm); Height - Seated (Max): 0.022" (0.55mm); Number of Terminations: 2; Failure Rate: -
R75 R76 R87 R93-R95 = ERJ-3EKF1002V: RES SMD 10K OHM 1% 1/10W 0603; Manufacturer: Panasonic Electronic Components; Factory Stock: 0; Unit Price (USD): 0.00379; @ qty: 1500; Minimum Quantity: 1; Power (Watts): 0.1W, 1/10W; Temperature Coefficient: ±100ppm/°C; Part Number: ERJ-3EKF1002V; Datasheets: http://industrial.panasonic.com/www-cgi/jvcr13pz.cgi?E+PZ+3+AOA0002+ERJ3EKF1002V+7+WW; Image: //media.digikey.com/Photos/Panasonic%20Photos/MFG_ERJ-P6W%20Series.jpg; Digi-Key Part Number: P10.0KHCT-ND; Quantity Available: 6703141; Packaging: Cut Tape (CT); Series: ERJ; Part Status: Active; Value: 10k; Tolerance: ±1%; Composition: Thick Film; Features: Automotive AEC-Q200; Operating Temperature: -55°C ~ 155°C; Package / Case: 0603 (1608 Metric); Supplier Device Package: 0603; Size / Dimension: 0.063" L x 0.031" W (1.60mm x 0.80mm); Height - Seated (Max): 0.022" (0.55mm); Number of Terminations: 2; Failure Rate: -
R77 R79 = ERJ-3EKF2742V: RES SMD 27.4K OHM 1% 1/10W 0603; Manufacturer: Panasonic Electronic Components; Factory Stock: 0; Unit Price (USD): 0.00379; @ qty: 1500; Minimum Quantity: 1; Power (Watts): 0.1W, 1/10W; Temperature Coefficient: ±100ppm/°C; Part Number: ERJ-3EKF2742V; Datasheets: http://industrial.panasonic.com/www-cgi/jvcr13pz.cgi?E+PZ+3+AOA0002+ERJ3EKF2742V+7+WW; Image: //media.digikey.com/Photos/Panasonic%20Photos/MFG_ERJ-P6W%20Series.jpg; Digi-Key Part Number: P27.4KHCT-ND; Quantity Available: 97674; Packaging: Cut Tape (CT); Series: ERJ; Part Status: Active; Value: 27.4k; Tolerance: ±1%; Composition: Thick Film; Features: Automotive AEC-Q200; Operating Temperature: -55°C ~ 155°C; Package / Case: 0603 (1608 Metric); Supplier Device Package: 0603; Size / Dimension: 0.063" L x 0.031" W (1.60mm x 0.80mm); Height - Seated (Max): 0.022" (0.55mm); Number of Terminations: 2; Failure Rate: -
R82 = ERJ-3EKF2802V: RES SMD 28K OHM 1% 1/10W 0603; Manufacturer: Panasonic Electronic Components; Factory Stock: 0; Unit Price (USD): 0.00379; @ qty: 1500; Minimum Quantity: 1; Power (Watts): 0.1W, 1/10W; Temperature Coefficient: ±100ppm/°C; Part Number: ERJ-3EKF2802V; Datasheets: http://industrial.panasonic.com/www-cgi/jvcr13pz.cgi?E+PZ+3+AOA0002+ERJ3EKF2802V+7+WW; Image: //media.digikey.com/Photos/Panasonic%20Photos/MFG_ERJ-P6W%20Series.jpg; Digi-Key Part Number: P28.0KHCT-ND; Quantity Available: 88206; Packaging: Cut Tape (CT); Series: ERJ; Part Status: Active; Value: 28k; Tolerance: ±1%; Composition: Thick Film; Features: Automotive AEC-Q200; Operating Temperature: -55°C ~ 155°C; Package / Case: 0603 (1608 Metric); Supplier Device Package: 0603; Size / Dimension: 0.063" L x 0.031" W (1.60mm x 0.80mm); Height - Seated (Max): 0.022" (0.55mm); Number of Terminations: 2; Failure Rate: -
R83 = ERJ-3EKF1503V: RES SMD 150K OHM 1% 1/10W 0603; Manufacturer: Panasonic Electronic Components; Factory Stock: 0; Unit Price (USD): 0.00379; @ qty: 1500; Minimum Quantity: 1; Power (Watts): 0.1W, 1/10W; Temperature Coefficient: ±100ppm/°C; Part Number: ERJ-3EKF1503V; Datasheets: http://industrial.panasonic.com/www-cgi/jvcr13pz.cgi?E+PZ+3+AOA0002+ERJ3EKF1503V+7+WW; Image: //media.digikey.com/Photos/Panasonic%20Photos/MFG_ERJ-P6W%20Series.jpg; Digi-Key Part Number: P150KHCT-ND; Quantity Available: 218174; Packaging: Cut Tape (CT); Series: ERJ; Part Status: Active; Value: 150k; Tolerance: ±1%; Composition: Thick Film; Features: Automotive AEC-Q200; Operating Temperature: -55°C ~ 155°C; Package / Case: 0603 (1608 Metric); Supplier Device Package: 0603; Size / Dimension: 0.063" L x 0.031" W (1.60mm x 0.80mm); Height - Seated (Max): 0.022" (0.55mm); Number of Terminations: 2; Failure Rate: -
SB20-SB22 = Solder Bridge: Circuit Breaker; Published: 24-Mar-1999; Revision: July-2002: Re-released for DXP Platform.; Publisher: Altium Limited
U4 = CMP-0000-28951-2: UCC28951 Phase-Shifted Full-Bridge Controller / for Wide Input-Voltage Range Applications; ComponentLink1Description: Datasheet; ComponentLink1URL: https://www.ti.com/lit/ds/symlink/ucc28951.pdf?ts=1588485726454
U6 = CMP-0366-00644-2: Adjustable Precision Shunt Regulator, 34 ppm / degC, 100 mA, -40 to 85 degC, 5-pin SOT-23 (DBV), Green (RoHS & no Sb/Br); Manufacturer: Texas Instruments; Iout/Iz(Max)(mA): 100; Min Iz for Regulation(uA): 600; Temp Coeff(Typ)(ppm/ degree C): 34; SubFamily: Shunt Voltage Reference; Temp Coeff(Max)(ppm/ degree C): 92; VO Adj(Min)(V): 2.495; Rating: Military; VO Adj(Max)(V): 36; Initial Accuracy @ 25/deg C(%): 2; Eco-Plan: Green (RoHS & no Sb/Br); Mounting Technology: Surface Mount; Code_JEDEC: MO-178; DatasheetVersion: SLVS543M; ComponentLink3Description: Package Specification; PackageReference: DBV0005A; ComponentLink3URL: http://www.ti.com/litv/pdf/mpds018i; PackageVersion: 4073253-4/K; ComponentLink1URL: http://www.ti.com/; ComponentLink1Description: Manufacturer URL; ComponentLink2URL: http://www.ti.com/general/docs/lit/getliterature.tsp?genericPartNumber=TL431&fileType=pdf; ComponentLink2Description: Datasheet; PackageDescription: 5-Pin Plastic Small Outline, Body 1.60 Ã— 2.90 mm, Pitch 0.95 mm; PartNumber: TL431IDBVR
U7 = CMP-0017-00287-2: Dual Single Supply Operational Amplifier, 3 to 16 V, 0 to 70 degC, 8-pin SOIC (D8), Green (RoHS & no Sb/Br); Manufacturer: Texas Instruments; IIB(Max)(pA): 60; Slew Rate(Typ)(V/us): 3.6; GBW(Typ)(MHz): 1.7; Rating: Military; Total Supply Voltage(Max)(+5V is 5, +/-5V is 10): 16; CMRR(Min)(dB): 65; Iq per channel(Max)(mA): 1.6; Vio (25C)(Max)(mV): 10; Number of Channels: 2; Total Supply Voltage(Min)(+5V is 5, +/-5V is 10): 3; Offset Drift(Typ)(uV/C): 1.8; Vn at 1kHz(Typ)(nV/rtHz): 25; Sub Family: General Purpose Amplifier; Code_JEDEC: MS-012; ComponentLink2URL: http://www.ti.com/lit/ds/symlink/tlc272.pdf; DatasheetVersion: SLOS091E; ComponentLink3Description: Package Specification; ComponentLink1URL: http://www.ti.com/; ComponentLink2Description: Datasheet; PackageReference: D0008A; ComponentLink3URL: http://www.ti.com/litv/pdf/msoi002j; PartNumber: TLC272CD; ComponentLink1Description: Manufacturer URL; Mounting Technology: Surface Mount; PackageVersion: 4040047-3/M, 06/2011; PackageDescription: 8-Pin Plastic Small Outline, Body 4.9 x 3.9 mm, Pitch 1.27 mm; Eco-Plan: Green (RoHS & no Sb/Br)

## Nets that join several sheets
3.3V_D: MCU_Breakout (R2.1), MCU_Power (20 pins), MCU_LCD (P3.11 P3.13), MCU_CAN (SB40.1 SB42.1), Power (7 pins), Ucc_28951_Breakout (R75.1 R94.1)
5V_D: MCU_Power (Q8.3 R12.2), MCU_USB (R17.1), MCU_LCD (P3.17 P3.19), MCU_CAN (8 pins), Power (18 pins)
15V_C: Power (9 pins), Ucc_28951_Breakout (6 pins)
E3.3V: MCU_Debug (P2.2 P2.4 P2.6), Power (D1.2)
E5V: MCU_Debug (P2.8 P2.10 P2.12), Power (D6.2)
GND_C: MCU_Breakout (8 pins), MCU_Power (27 pins), MCU_Debug (14 pins), MCU_USB (7 pins), MCU_LCD (P3.15 P3.18 P3.20), IR_Reciever (C16.2 U3.2), MCU_CAN (20 pins), Power (27 pins), Ucc_28951_Breakout (R93.1 U6.5)
OPAMP_COMP_VCC: Power (SB48.2 SB49.2), Ucc_28951_Breakout (C97.1 C98.1 C99.2 U7.8)
OPAMP_COMP_VSS: Power (SB46.2 SB47.2), Ucc_28951_Breakout (C97.2 C98.2 C99.1 U7.4)
U5V: MCU_USB (C15.1 C67.1 D7.1), Power (D3.2)
120V_Sense: Edge_Card_Connector (P1.B13), MCU_Breakout (U1.21), Ucc_28951_Breakout (R46.1 R49.1 R64.1 TP2.1)
A15_SYS_JTDI: MCU_Breakout (SB16.2), MCU_Debug (D12.1 P2.5)
ACS_HV_OUT_AMP: Edge_Card_Connector (P1.B2), MCU_Breakout (U1.18), Ucc_28951_Breakout (D19.1 R57.2)
ACS_LV_OUT_AMP: Edge_Card_Connector (P1.B12), MCU_Breakout (U1.22), Ucc_28951_Breakout (R61.1 R80.1 TP6.1)
AMC_HV_OUT: Edge_Card_Connector (P1.B1), MCU_Breakout (U1.17)
DIS1: Edge_Card_Connector (P1.B5), MCU_Breakout (R98.2 S2.5)
DIS2: Edge_Card_Connector (P1.B6), MCU_Breakout (R99.2 S2.6)
Driver_Enable_SIG: Edge_Card_Connector (P1.A49), MCU_Breakout (U1.55)
E_SW_Control: Edge_Card_Connector (P1.B15), MCU_Breakout (R100.2 S2.7)
EN_28951: MCU_Breakout (U1.66), Ucc_28951_Breakout (R53.1)
ENFAN: Edge_Card_Connector (P1.B18), MCU_Breakout (U1.84)
ENSRG: Edge_Card_Connector (P1.B11), MCU_Breakout (R101.2 S2.8)
FAN_PWM_A: Edge_Card_Connector (P1.B16), MCU_Breakout (U1.85)
FAN_PWM_B: Edge_Card_Connector (P1.B17), MCU_Breakout (U1.86)
FDCAN_N: MCU_Breakout (SB3.1), MCU_CAN (Q4.1 R32.2 U12.3)
FDCAN_P: MCU_Breakout (SB4.1), MCU_CAN (Q2.1 R27.2 U12.2)
I_Ref: MCU_Breakout (U1.27), Ucc_28951_Breakout (R85.1)
I_ref_PWM: MCU_Breakout (U1.16), Ucc_28951_Breakout (R92.1)
INA1: Edge_Card_Connector (P1.B3), Ucc_28951_Breakout (U4.22)
INA2: Edge_Card_Connector (P1.B8), Ucc_28951_Breakout (U4.20)
INB1: Edge_Card_Connector (P1.B4), Ucc_28951_Breakout (U4.21)
INB2: Edge_Card_Connector (P1.B7), Ucc_28951_Breakout (U4.19)
IR_IN: MCU_Breakout (SB12.1 SB15.1), IR_Reciever (U3.1)
LCD_CS: MCU_Breakout (U1.40), MCU_LCD (P3.3)
LCD_D0: MCU_Breakout (U1.97), MCU_LCD (P3.14)
LCD_D1: MCU_Breakout (U1.98), MCU_LCD (P3.16)
LCD_D2: MCU_Breakout (U1.1), MCU_LCD (P3.2)
LCD_D3: MCU_Breakout (U1.2), MCU_LCD (P3.4)
LCD_D4: MCU_Breakout (U1.3), MCU_LCD (P3.6)
LCD_D5: MCU_Breakout (U1.4), MCU_LCD (P3.8)
LCD_D6: MCU_Breakout (U1.5), MCU_LCD (P3.10)
LCD_D7: MCU_Breakout (U1.38), MCU_LCD (P3.12)
LCD_RD: MCU_Breakout (U1.43), MCU_LCD (P3.9)
LCD_RS: MCU_Breakout (U1.41), MCU_LCD (P3.5)
LCD_RST: MCU_Breakout (U1.39), MCU_LCD (P3.1)
LCD_WR: MCU_Breakout (U1.42), MCU_LCD (P3.7)
Mains_Sense: Edge_Card_Connector (P1.A48), MCU_Breakout (U1.53)
OC_SIG: Edge_Card_Connector (P1.A44), MCU_Breakout (U1.54)
OV_SIG: Edge_Card_Connector (P1.A42), MCU_Breakout (U1.52)
PB3_SYS_JTDO_TRACESWO: MCU_Breakout (SB6.1), MCU_Debug (D11.1 P2.3)
PB4_SYS_NJTRST: MCU_Breakout (SB5.1), MCU_Debug (D10.1 P2.1)
Relay_SIG_PFC_SD: Edge_Card_Connector (P1.A46), MCU_Breakout (U1.57)
Relay_SIG_Thermistor_PFC_SD: Edge_Card_Connector (P1.A47), MCU_Breakout (U1.56)
SD_SIG: Edge_Card_Connector (P1.A45), MCU_Breakout (S2.2 U1.58)
SRG_A: Edge_Card_Connector (P1.B10), Ucc_28951_Breakout (U4.18)
SRG_B: Edge_Card_Connector (P1.B9), Ucc_28951_Breakout (U4.17)
SWCLK: MCU_Breakout (SB14.2), MCU_Debug (D14.1 P2.9)
SWDIO: MCU_Breakout (SB13.2), MCU_Debug (D13.1 P2.7)
SYNC: MCU_Breakout (U1.65), Ucc_28951_Breakout (SB21.1)
T1_SMB_INT: Edge_Card_Connector (P1.B24), MCU_Breakout (U1.70)
T1_SMB_RST: Edge_Card_Connector (P1.B23), MCU_Breakout (U1.69)
T1_SMB_SCL: Edge_Card_Connector (P1.B22), MCU_Breakout (U1.67)
T1_SMB_SDA: Edge_Card_Connector (P1.B21), MCU_Breakout (U1.68)
TACH_OUT_FAN__A: Edge_Card_Connector (P1.B20), MCU_Breakout (R102.2)
TACH_OUT_FAN__B: Edge_Card_Connector (P1.B19), MCU_Breakout (R103.1)
USART1_RX: MCU_Breakout (SB18.2), MCU_Debug (D9.1 P2.17)
USART1_TX: MCU_Breakout (SB17.2), MCU_Debug (D8.1 P2.19)
USB_N: MCU_Breakout (SB1.1), MCU_USB (R15.1)
USB_P: MCU_Breakout (SB2.1), MCU_USB (R16.1 R17.2)
UV_SIG: Edge_Card_Connector (P1.A43), MCU_Breakout (U1.51)
V_Ref: MCU_Breakout (U1.26), Ucc_28951_Breakout (R68.1)
V_ref_PWM: MCU_Breakout (U1.15), Ucc_28951_Breakout (R74.1)